# Altium schematic sheet Sheet1.SchDoc
size A; SheetNumber: 1; SheetTotal: 1
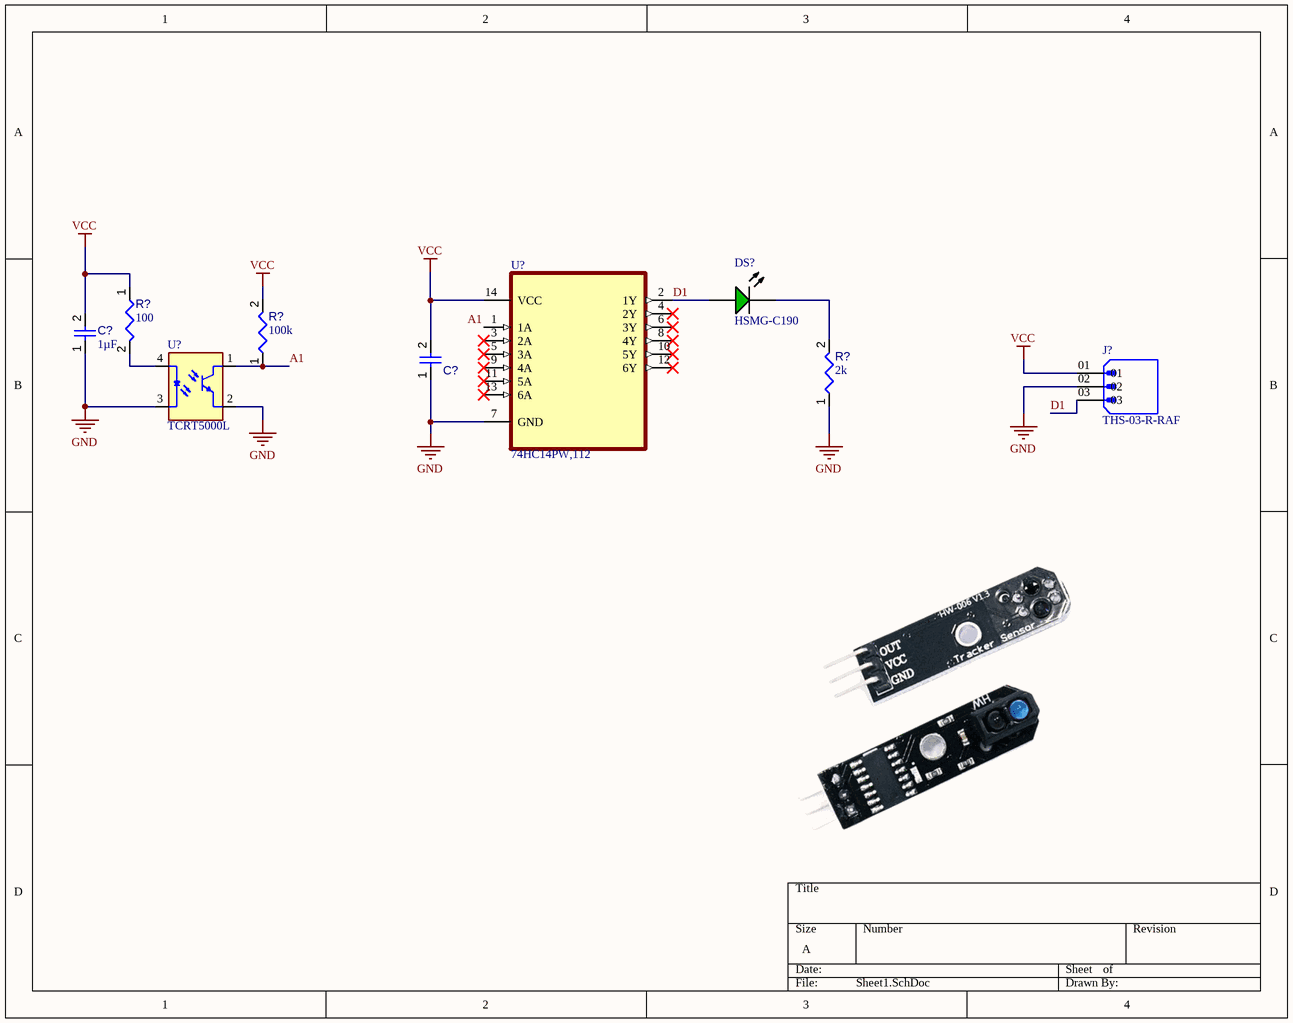
[diagram p0: Sheet1.SchDoc]

## Parts
(Parts that share a designator on the sheet are numbered #1, #2 ... from top to bottom, then left to right.)
C?#1  value 1µF  [CAPC2013X145X50ML20T25]  (hidden comment: Capacitor 1 uF +/- 10% 25 V 0805)
C?#2  Capacitor 1 uF +/- 10% 25 V 0805  [CAPC2013X145X50ML20T25]  (value not drawn)
DS?  HSMG-C190  [AVAG-HSMX-C190_V]
J?  THS-03-R-RAF  [VALCON_THS-03-R-RAF]
R?#1  value 100  [RESC0402(1005)_L]  (hidden comment: Resistor 100R +/-1 % 0402 63 mW)
R?#2  value 100k  [RESC1005X40X25ML05T05]  (hidden comment: Resistor 100k +/-1% 0402 63 mW)
R?#3  value 2k  [RESC0402(1005)_L]  (hidden comment: Resistor 2K +/-5 % 0402 63 mW)
U?#1  74HC14PW,112  [SOP65P640X110-14N]
U?#2  TCRT5000L  [XDCR_TCRT5000L]

## Nets
GND: C?#1.1 C?#2.1 J?.02 R?#3.1 U?#1.7(GND) U?#2.2(E) U?#2.3(C)
VCC: C?#1.2 C?#2.2 J?.01 R?#1.1 R?#2.2 U?#1.14(VCC)
A1: R?#2.1 U?#1.1(1A) U?#2.1(CO)
D1: DS?.1(A) J?.03 U?#1.2(1Y)
NetDS?_2: DS?.2(K) R?#3.2
NetR?#1_2: R?#1.2 U?#2.4(A)

Not connected (* = marked no-connect by the designer): U?#1 3(2A)* 4(2Y)* 5(3A)* 6(3Y)* 8(4Y)* 9(4A)* 10(5Y)* 11(5A)* 12(6Y)* 13(6A)*

## Library data of the parts
C?#1 = CMP-001-00010-6: Chip Capacitor, 1 uF, +/-10%, 25 V, 0805 (2012 Metric); Capacitor Type: Ceramic; Voltage Rating: 25V; RoHS Compliant: True; Pins: 2; Mounting Technology: SM; Max Operating Temperature: 125°C; Min Operating Temperature: -55°C; Tolerance: 10%; Case/Package: 0805
C?#2 = CMP-001-00010-6: Chip Capacitor, 1 uF, +/-10%, 25 V, 0805 (2012 Metric); Value: 1µF; Capacitor Type: Ceramic; Voltage Rating: 25V; RoHS Compliant: True; Pins: 2; Mounting Technology: SM; Max Operating Temperature: 125°C; Min Operating Temperature: -55°C; Tolerance: 10%; Case/Package: 0805
DS? = CMP-007-00013-2: LED Uni-Color Green, 52 mW, 20 mA, -40 to 85 degC, 2-Pin SMD, RoHS, Tape and Reel; Manufacturer: Avago; Forward Current: 20mA; Viewing Angle: 170degrees; Luminous Intensity: 15mcd; Lens Style: Diffused; Forward Voltage: 2.2V; Power: 52mW; Mounting Technology: SM; RoHS Compliant: True; Packaging: TapeandReel; Illumination Colour: Green; Datasheet URL: http://docs.avagotech.com/docs/AV02-0551EN; Min Operating Temperature: -40°C; Max Operating Temperature: 85°C; Pins: 2; Package Description: 2-Pin Surface Mount Device, Body 1.6 x 0.8 mm, Height 0.9 mm; Nominal Vf: 2.2V; Case/Package: 0603; Manufacturer URL: http://www.avagotech.com/; Datasheet Version: Mar-12; Colour: Green; Package Reference: HSMX-C190; Package Quantity: 4000
R?#1 = CMP-009-00167-3: Chip Resistor, 100 Ohms, +/-1 %, 63 mW, -55 to 155 degC, 0402; Power: 63mW; Tolerance: 1%; Min Operating Temperature: -55°C; Case/Package: 0402; Pins: 2; Max Operating Temperature: 155°C
R?#2 = CMP-009-00021-5: Chip Resistor, 100 KOhm, +/- 1%, 0.063 W, -55 to 155 degC, 0402 (1005 Metric); Voltage Rating: 50V; Power: 63mW; Pins: 2; Tolerance: 1%; Max Operating Temperature: 155°C; Case/Package: 0402; Min Operating Temperature: -55°C; Mounting Technology: SM; RoHS Compliant: True
R?#3 = CMP-009-00138-3: Chip Resistor, 2 kOhms, +/-5 %, 63 mW, -55 to 155 degC, 0402; Tolerance: 5%; Power: 63mW; Max Operating Temperature: 155°C; Pins: 2; Min Operating Temperature: -55°C; Case/Package: 0402
U?#1 = 74HC14PW,112: Inverter IC 6 Channel Schmitt Trigger 14-TSSOP; MF: Nexperia; Purchase-URL: https://pricing.snapeda.com/search/part/74HC14PW,112/?ref=eda; Value: *; MP: 74HC14PW,112; Package: TSSOP14-14 Nexperia USA Inc.; Price: None; SnapEDA_Link: https://www.snapeda.com/parts/74HC14PW,112/Nexperia/view-part/1039907/?ref=snap; Availability: Good; Check_prices: https://www.snapeda.com/parts/74HC14PW,112/Nexperia/view-part/1039907/?ref=eda
U?#2 = TCRT5000L: Reflective Optical Sensor 0.591 _15mm_ PCB Mount; MF: Vishay; MP: TCRT5000L; Package: PCB Mount Vishay Semiconductor; SnapEDA_Link: https://www.snapeda.com/parts/TCRT5000L/Vishay%20Semiconductor%20Opto%20Division/view-part/229608/?ref=snap; Availability: Unavailable; Value: *; Price: None
J? = THS-03-R-RAF: Price: None; Package: None; Value: *; MP: THS-03-R-RAF; Availability: Unavailable